# Altium schematic sheet Sheet_pwm.SchDoc
size A; SheetNumber: 1; SheetTotal: 1
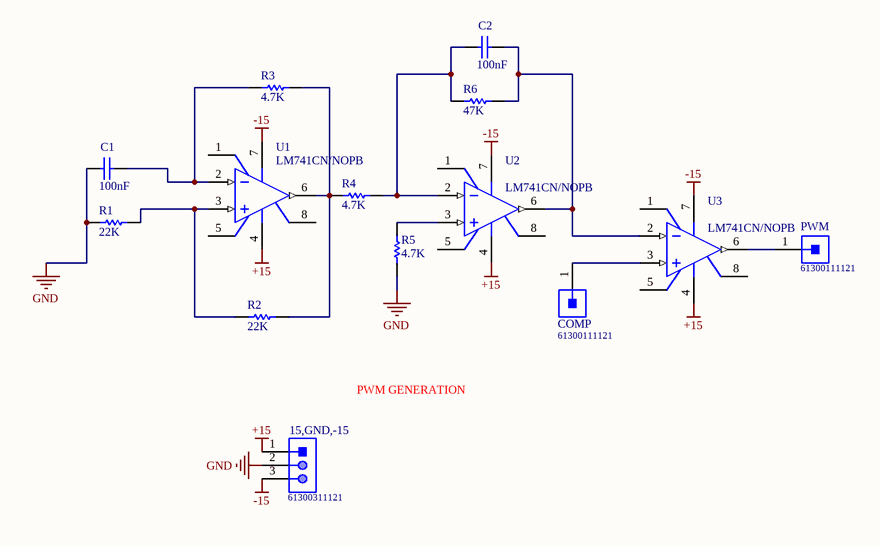
[diagram p0: Sheet_pwm.SchDoc]

## Parts
15,GND,-15  61300311121  [61300311121]
C1  100nF  [KEMT-C315-THT-2]
C2  100nF  [KEMT-C315-THT-2]
COMP  61300111121  [61300111121]
PWM  61300111121  [61300111121]
R1  22K  [RESA60-630X240]
R2  22K  [RESA60-630X240]
R3  4.7K  [RESA60-630X240]
R4  4.7K  [RESA60-630X240]
R5  4.7K  [RESA60-630X240]
R6  47K  [RESA60-630X240]
U1  LM741CN/NOPB  [P0008A]
U2  LM741CN/NOPB  [P0008A]
U3  LM741CN/NOPB  [P0008A]

## Nets
+15: 15,GND,-15.1 U1.4(V-) U2.4(V-) U3.4(V-)
-15: 15,GND,-15.3 U1.7(V+) U2.7(V+) U3.7(V+)
GND: 15,GND,-15.2 C1.1 R1.1 R5.1
NetC1_2: C1.2 R3.1 U1.2(IN-)
NetC2_1: C2.1 R4.2 R6.1 U2.2(IN-)
NetC2_2: C2.2 R6.2 U2.6(OUT) U3.2(IN-)
NetCOMP_1: COMP.1 U3.3(IN+)
NetPWM_1: PWM.1 U3.6(OUT)
NetR1_2: R1.2 R2.1 U1.3(IN+)
NetR2_2: R2.2 R3.2 R4.1 U1.6(OUT)
NetR5_2: R5.2 U2.3(IN+)

Not connected (* = marked no-connect by the designer): U1 1(OFS_NULL) 5(OFS_NULL) 8(NC); U2 1(OFS_NULL) 5(OFS_NULL) 8(NC); U3 1(OFS_NULL) 5(OFS_NULL) 8(NC)

## Notes on the sheet
- PWM GENERATION

## Library data of the parts
15,GND,-15 = CMP-1502-01062-1: THT Vertical Pin Header WR-PHD, Pitch 2.54 mm, Single Row, 3 pins; Manufacturer: Wurth Elektronik; Withstanding Voltage: 500VAC; Working Voltage: 250VAC; Rated Current: 3A; Pitch: 2.54mm; Pin Number: 3; Gender: Male; Contact Resistance: 20mOhm; Package Reference: 61300311121; Manufacturer URL: http://www.we-online.de; Datasheet URL: https://katalog.we-online.de/em/datasheet/6130xx11121.pdf; Operating Temperature: -40to105degC; Part Number: 61300311121; Orientation: Vertical; Packaging: Bag; Row Number: Single; Mounting Technology: THT; Publisher: WurthElektronik
C1 C2 = CMP-1664-00007-1: Capacitor, Ceramic, 0.01 uF, +/- 10%, 100 V, X7R, -55 to 125 degC, 2-Pin THD, RoHS, Bulk; Output Voltage: 70 V; Case\Package: PDIP; Forward Current: 60 mA; Nominal Vf: 1.3 V; Forward Voltage: 1.5 V; Channels: 2; Max Power Dissipation: 400 mW; Vce Max: 500 mV; ComponentLink1Description: Manufacturer URL; ComponentLink2Description: Datasheet; Packaging: Rail/Tube; RoHSCompliant: true; Package Quantity: 2000; PackageReference: C315-THT-2; Min Operating Temperature: -55 degC; Max Operating Temperature: 100 degC; Radiation Hardening: No; ComponentLink1URL: http://www.kemet.com/; DatasheetVersion: Aug-16; Pins: 16; PackageDescription: 2-Pin Through Hole Device, Body 3.81 x 2.54 mm; REACH SVHC: Unknown; Mount: Through Hole; ComponentLink2URL: http://capacitoredge.kemet.com/capedge2/DataSheet/Datasheet-C315C103K1R5TA.pdf?pn=C315C103K1R5TA{BULK}
COMP PWM = CMP-1502-01058-1: THT Vertical Pin Header WR-PHD, Pitch 2.54 mm, Single Row, 1 pins; Manufacturer: Wurth Elektronik; Gender: Male; Working Voltage: 250VAC; Withstanding Voltage: 500VAC; Pin Number: 1; Contact Resistance: 20mOhm; Rated Current: 3A; Pitch: 2.54mm; Mounting Technology: THT; Datasheet URL: https://katalog.we-online.de/em/datasheet/6130xx11121.pdf; Manufacturer URL: http://www.we-online.de; Operating Temperature: -40to105degC; Publisher: WurthElektronik; Part Number: 61300111121; Row Number: Single; Package Reference: 61300111121; Orientation: Vertical; Packaging: Bag
R1-R6 = CMP-1659-00075-1: Axial Resistor, 1 KOhm, +/- 1%, 250 mW, -55 to 155 degC, 2-Pin THD, RoHS, Bulk; Voltage Rating: 250 V; Resistance: 10 kohm; Power Rating: 250 mW; ComponentLink2Description: Datasheet; RoHSCompliant: true; PackageReference: MFR-25; Case\Package: Axial; Max Operating Temperature: 155 degC; DatasheetVersion: Apr-13; Tolerance: 1%; ComponentLink1URL: http://www.yageo.com/; Length: 0.248 inch; ComponentLink2URL: http://www.yageo.com/documents/recent/Yageo%20LR_MFR_2013.pdf; Packaging: Bulk; Package Quantity: 200; PackageDescription: 2-Pin Axial Lead, Dia 2.4 mm, Body Length 6.3 mm; Min Operating Temperature: -55 degC; ComponentLink1Description: Manufacturer URL
U1-U3 = CMP-0055-00162-3: Operational Amplifier, 8-pin MDIP, Pb-Free; Manufacturer: Texas Instruments; PackageTopMarking: NSUZXYTTE#*LM*741CN; PowerWise: N; CompType: Amplifiers; ComponentLink1Description: Datasheet URL; ComponentLink1URL: http://www.ti.com/general/docs/lit/getliterature.tsp?genericPartNumber=LM741&fileType=pdf; PackageDescription: MDIP, .365 x .250 x .130in, 8 Lead, .100in Pitch; RoHS: Y; PinCount: 8; Code_JEDEC: MS-001-BA; Package Reference: P0008A